# EAGLE design lipo_status (EAGLE 6.6.0)
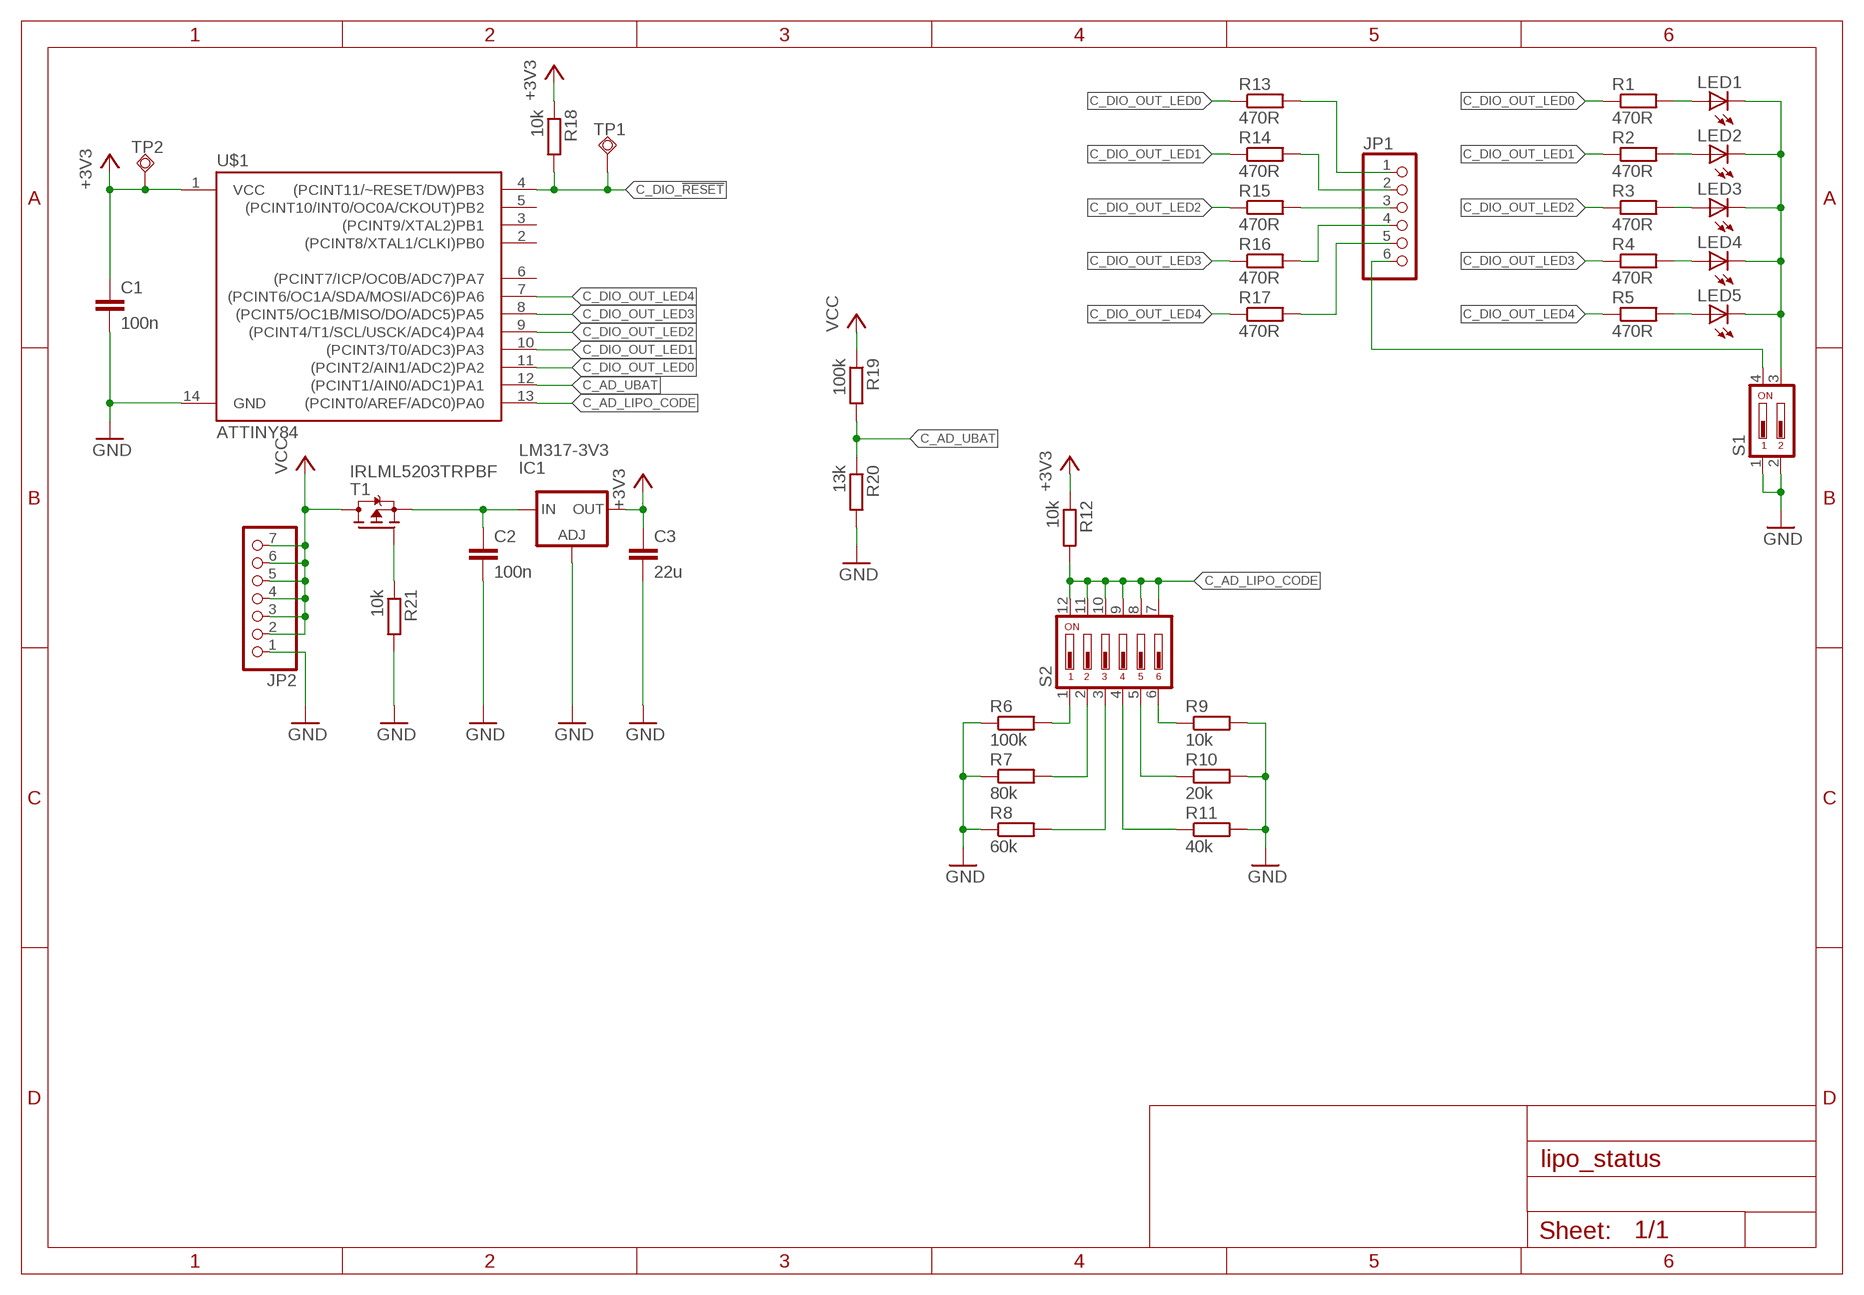
[diagram p0: schematic, sheet 1]

## Parts
C1  100n  C-EUC0603  [C0603]
C2  100n  C-EUC0805  [C0805]
C3  22u  C-EUC0805  [C0805]
IC1  LM317-3V3  LM317MBSTT3  [SOT223]
JP1  PINHD-1X6  [1X06]
JP2  PINHD-1X7  [1X07]
LED1  LEDCHIP-LED0805  [CHIP-LED0805]
LED2  LEDCHIP-LED0805  [CHIP-LED0805]
LED3  LEDCHIP-LED0805  [CHIP-LED0805]
LED4  LEDCHIP-LED0805  [CHIP-LED0805]
LED5  LEDCHIP-LED0805  [CHIP-LED0805]
R1  470R  R-EU_R0603  [R0603]
R2  470R  R-EU_R0603  [R0603]
R3  470R  R-EU_R0603  [R0603]
R4  470R  R-EU_R0603  [R0603]
R5  470R  R-EU_R0603  [R0603]
R6  100k  R-EU_R0603  [R0603]
R7  80k  R-EU_R0603  [R0603]
R8  60k  R-EU_R0603  [R0603]
R9  10k  R-EU_R0603  [R0603]
R10  20k  R-EU_R0603  [R0603]
R11  40k  R-EU_R0603  [R0603]
R12  10k  R-EU_R0603  [R0603]
R13  470R  R-EU_R0603  [R0603]
R14  470R  R-EU_R0603  [R0603]
R15  470R  R-EU_R0603  [R0603]
R16  470R  R-EU_R0603  [R0603]
R17  470R  R-EU_R0603  [R0603]
R18  10k  R-EU_R0603  [R0603]
R19  100k  R-EU_R0603  [R0603]
R20  13k  R-EU_R0603  [R0603]
R21  10k  R-EU_R0603  [R0603]
S1  DIP02YL  [DIP02YL]
S2  DIP06YL  [DIP06YL]
T1  IRLML5203TRPBF  [SOT23]
TP1  TPSQPAD1-13  [P1-13]
TP2  TPSQPAD1-13  [P1-13]
U$1  ATTINY84  [SO14]

## Nets
+3V3: C1.1 C3.1 IC1.4(OUT) R12.1 R18.1 TP2.TP U$1.1(VCC)
C_AD_LIPO_CODE: R12.2 S2.7 S2.8 S2.9 S2.10 S2.11 S2.12 U$1.13((PCINT0/AREF/ADC0)PA0)
C_AD_UBAT: R19.2 R20.1 U$1.12((PCINT1/AIN0/ADC1)PA1)
C_DIO_!RESET: R18.2 TP1.TP U$1.4((PCINT11/~RESET/DW)PB3)
C_DIO_OUT_LED0: R1.1 R13.1 U$1.11((PCINT2/AIN1/ADC2)PA2)
C_DIO_OUT_LED1: R2.1 R14.1 U$1.10((PCINT3/T0/ADC3)PA3)
C_DIO_OUT_LED2: R3.1 R15.1 U$1.9((PCINT4/T1/SCL/USCK/ADC4)PA4)
C_DIO_OUT_LED3: R4.1 R16.1 U$1.8((PCINT5/OC1B/MISO/DO/ADC5)PA5)
C_DIO_OUT_LED4: R5.1 R17.1 U$1.7((PCINT6/OC1A/SDA/MOSI/ADC6)PA6)
GND: C1.2 C2.2 C3.2 IC1.1(ADJ) JP2.1 R6.1 R7.1 R8.1 R9.2 R10.2 R11.2 R20.2 R21.2 S1.1 S1.2 U$1.14(GND)
N$1: LED1.A R1.2
N$2: LED2.A R2.2
N$3: LED3.A R3.2
N$4: LED4.A R4.2
N$5: LED5.A R5.2
N$6: R6.2 S2.1
N$7: R7.2 S2.2
N$8: R8.2 S2.3
N$9: R9.1 S2.6
N$10: R10.1 S2.5
N$11: R11.1 S2.4
N$12: JP1.6 S1.4
N$13: JP1.5 R17.2
N$14: JP1.4 R16.2
N$15: JP1.3 R15.2
N$16: LED1.C LED2.C LED3.C LED4.C LED5.C S1.3
N$17: JP1.2 R14.2
N$18: JP1.1 R13.2
N$19: R21.1 T1.1(G)
N$20: C2.1 IC1.3(IN) T1.2(S)
VCC: JP2.2 JP2.3 JP2.4 JP2.5 JP2.6 JP2.7 R19.1 T1.3(D)
Unconnected: U$1.2((PCINT8/XTAL1/CLKI)PB0) U$1.3((PCINT9/XTAL2)PB1) U$1.5((PCINT10/INT0/OC0A/CKOUT)PB2) U$1.6((PCINT7/ICP/OC0B/ADC7)PA7)

## Library data of the parts
C1-C3 = rcl:C-EU: CAPACITOR, European symbol
IC1 = v-reg:LM317?*: 500 mA Adjustable Output Positive Voltage Regulator Source: http://www.onsemi.co.jp .. LM317M-D.PDF
JP1 = pinhead:PINHD-1X6: PIN HEADER
JP2 = pinhead:PINHD-1X7: PIN HEADER
LED1-LED5 = led:LED: LED OSRAM: - CHIPLED LG R971, LG N971, LY N971, LG Q971, LY Q971, LO R971, LY R971 LH N974, LH R974 LS Q976, LO Q976, LY Q976 LO Q996 - Hyper CHIPLED LW Q18S LB Q993, LB Q99A, LB R99A - SideLED LS A670, LO A670, LY A670, LG A670, LP A670 LB A673, LV A673, LT A673, LW A673 LH A674 LY A675 LS A676, LA A676, LO A676, LY A676, LW A676 LS A679, LY A679, LG A679 - Hyper Micro SIDELED® LS Y876, LA Y876, LO Y876, LY Y876 LT Y87S - SmartLED LW L88C, LW L88S LB L89C, LB L89S, LG L890 LS L89K, LO L89K, LY L89K LS L896, LA L896, LO L896, LY L896 - TOPLED LS T670, LO T670, LY T670, LG T670, LP T670 LSG T670, LSP T670, LSY T670, LOP T670, LYG T670 LG T671, LOG T671, LSG T671 LB T673, LV T673, LT T673, LW T673 LH T674 LS T676, LA T676, LO T676, LY T676, LB T676, LH T676, LSB T676, LW T676 LB T67C, LV T67C, LT T67C, LS T67K, LO T67K, LY T67K, LW E67C LS E67B, LA E67B, LO E67B, LY E67B, LB E67C, LV E67C, LT E67C LW T67C LS T679, LY T679, LG T679 LS T770, LO T770, LY T770, LG T770, LP T770 LB T773, LV T773, LT T773, LW T773 LH T774 LS E675, LA E675, LY E675, LS T675 LS T776, LA T776, LO T776, LY T776, LB T776 LHGB T686 LT T68C, LB T68C - Hyper Mini TOPLED® LB M676 - Mini TOPLED Santana® LG M470 LS M47K, LO M47K, LY M47K Source: http://www.osram.convergy.de LUXEON: - LUMILED® LXK2-PW12-R00, LXK2-PW12-S00, LXK2-PW14-U00, LXK2-PW14-V00 LXK2-PM12-R00, LXK2-PM12-S00, LXK2-PM14-U00 LXK2-PE12-Q00, LXK2-PE12-R00, LXK2-PE12-S00, LXK2-PE14-T00, LXK2-PE14-U00 LXK2-PB12-K00, LXK2-PB12-L00, LXK2-PB12-M00, LXK2-PB14-N00, LXK2-PB14-P00, LXK2-PB14-Q00 LXK2-PR12-L00, LXK2-PR12-M00, LXK2-PR14-Q00, LXK2-PR14-R00 LXK2-PD12-Q00, LXK2-PD12-R00, LXK2-PD12-S00 LXK2-PH12-R00, LXK2-PH12-S00 LXK2-PL12-P00, LXK2-PL12-Q00, LXK2-PL12-R00 Source: www.luxeon.com KINGBRIGHT: KA-3528ASYC Source: www.kingbright.com
R1-R21 = rcl:R-EU_: RESISTOR, European symbol
S1 = switch-dil:DIP02YL: DIL/CODE SWITCH; OC_FARNELL: unknown; OC_NEWARK: unknown
S2 = switch-dil:DIP06YL: DIL/CODE SWITCH; OC_FARNELL: unknown; OC_NEWARK: unknown
T1 = SchlegelAr_Master:IRLML5203TRPBF: IRLML5203TRPBF - MOSFET MOSFT P-Ch -30V -3A 98mOhm 9.5nC Log Lvl last modified: Armin Schlegel, 28.04.2014 http://de.mouser.com/ProductDetail/International-Rectifier/IRLML5203TRPBF/?qs=sGAEpiMZZMshyDBzk1%2fWi5%252bqVgN3%252bWS8t7qb9msI9Rk%3d http://www.mouser.com/ds/2/200/irlml5203pbf-223113.pdf
TP1 TP2 = testpad:TPSQ: Test pad
U$1 = SparkFun-DigitalIC:ATTINY84: Atmel 14-pin 2/4/8kB flash uC; PROD_ID: IC-11285

## Board
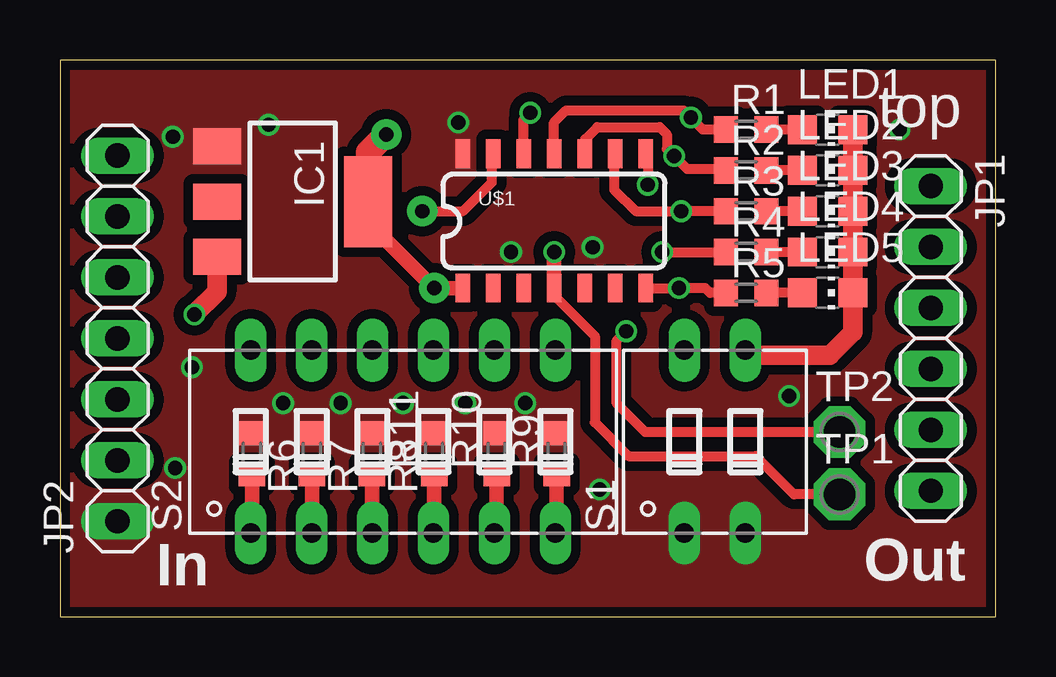
[diagram p1: board, top side]
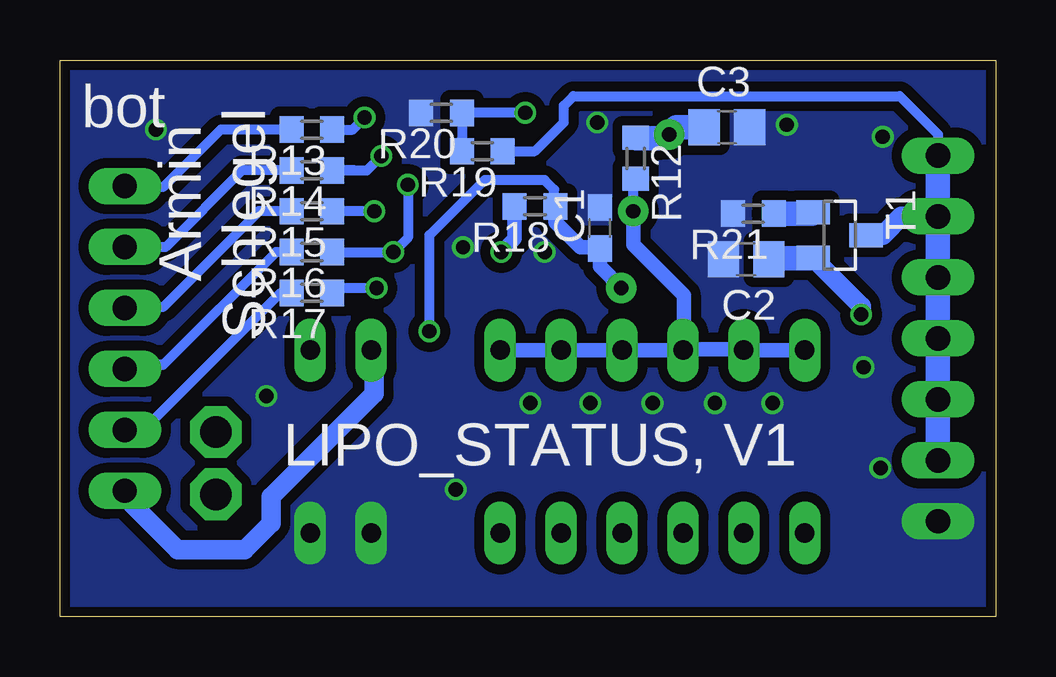
[diagram p2: board, bottom side, seen from below]

Size 39 x 23.2 mm. Coordinates in mm from the lower left corner, seen from the top.
Outline: 0,0 39,0 39,23.2 0,23.2 0,0
Copper layers (1*16): Top 0.035mm / dielectric 1.5mm / Bottom 0.035mm
Design rules "Elecrow_2-layer_eagle_rule": minimum track width 6mil, minimum drill 12mil, track to track 6mil, track to pad 6mil, pad to pad 6mil, via to via 6mil, smd to smd 0mil, copper to edge 10mil, drill to drill 10mil, minimum pad ring 10mil, minimum via ring 6mil, stop-mask expansion 2mil, vias tented up to drill 100mil, thermal gap 10mil

### Footprints (pad centres in the part's own frame; a part is rotated, then mirrored left to right if it is on the bottom)
C0603 = smd 1.1 x 1: 1 -0.85,0; 2 0.85,0
C0805 = smd 1.3 x 1.5: 1 -0.95,0; 2 0.95,0
SOT223 = smd 1.5 x 2: 1 -2.3,-3.15; 2 0,-3.15; 3 2.3,-3.15 | smd 3.8 x 2: 4 0,3.15
1X06 = drill 1.016 long: 1 -6.35,0; 2 -3.81,0; 3 -1.27,0; 4 1.27,0; 5 3.81,0; 6 6.35,0
1X07 = drill 1.016 long: 1 -7.62,0; 2 -5.08,0; 3 -2.54,0; 4 0,0; 5 2.54,0; 6 5.08,0; 7 7.62,0
CHIP-LED0805 = smd 1.2 x 1.2: A 0,-1.05; C 0,1.05
R0603 = smd 1 x 1.1: 1 -0.85,0; 2 0.85,0
DIP02YL = drill 0.813 long: 1 -1.27,-3.81; 2 1.27,-3.81; 3 1.27,3.81; 4 -1.27,3.81
DIP06YL = drill 0.813 long: 1 -6.35,-3.81; 2 -3.81,-3.81; 3 -1.27,-3.81; 4 1.27,-3.81; 5 3.81,-3.81; 6 6.35,-3.81; 7 6.35,3.81; 8 3.81,3.81; 9 1.27,3.81; 10 -1.27,3.81; 11 -3.81,3.81; 12 -6.35,3.81
SOT23 = smd 1 x 1.4: 1 -0.95,-1.1; 2 0.95,-1.1; 3 0,1.1
P1-13 = drill 1.321 pad 2.159 octagon: TP 0,0
SO14 = smd 0.6 x 1.2: 1 -3.81,-2.8; 2 -2.54,-2.8; 3 -1.27,-2.8; 4 0,-2.8; 5 1.27,-2.8; 6 2.54,-2.8; 7 3.81,-2.8; 8 3.81,2.8; 9 2.54,2.8; 10 1.27,2.8; 11 0,2.8; 12 -1.27,2.8; 13 -2.54,2.8; 14 -3.81,2.8

### Placement (x,y rotation side)
C1  16.5,16.2 90 bottom
C2  10.4,14.9 180 bottom
C3  11.2,20.4 0 bottom
IC1  9.7,17.3 270 top
JP1  36.3,11.6 270 top
JP2  2.4,11.6 90 top
LED1  32,20.3 270 top
LED2  32,18.6 270 top
LED3  32,16.9 270 top
LED4  32,15.2 270 top
LED5  32,13.5 270 top
R1  28.6,20.3 0 top
R2  28.6,18.6 0 top
R3  28.6,16.9 0 top
R4  28.6,15.2 0 top
R5  28.6,13.5 0 top
R6  8,6.8 270 top
R7  10.5,6.8 270 top
R8  13,6.8 270 top
R9  20.7,6.8 90 top
R10  18.2,6.8 90 top
R11  15.6,6.8 90 top
R12  15,19.1 270 bottom
R13  28.5,20.3 180 bottom
R14  28.5,18.6 180 bottom
R15  28.5,16.9 180 bottom
R16  28.5,15.2 180 bottom
R17  28.5,13.5 180 bottom
R18  19.2,17.1 180 bottom
R19  21.4,19.4 180 bottom
R20  23.1,21 180 bottom
R21  10.1,16.8 180 bottom
S1  27.3,7.3 0 top
S2  14.3,7.3 0 top
T1  6.5,15.9 270 bottom
TP1  32.5,5.1 0 top
TP2  32.5,7.7 0 top
U$1  20.6,16.5 0 top

### Tracks (layer width: path | path; a pad name or v marks a point on that pad's centre or on a via)
+3V3  (via drill 0.6 pad 0.81, 0.6 pad 1.27)
  Top 0.406: TP2.TP 24.4,7.7 23.2,8.9 23.2,11.5 v23.6,11.9
  Top 0.61: U$1.1 v15.6,13.7 12.85,16.45 IC1.4
  Top 1.016: IC1.4 12.85,19.35 v13.6,20.1
  Bottom 0.406: v23.6,11.9 23.6,15.9 21.3,18.2 18.8,18.2 18.4,17.8 18.4,17.15 R18.1
  Bottom 0.61: v15.6,13.7 16.5,14.6 C1.1 16.55,15.4 17.3,15.4 18.35,16.45 R18.1
  Bottom 1.016: R12.1 14.05,19.95 v13.6,20.1 13.3,20.4 C3.1
C_AD_LIPO_CODE  (via drill 0.6 pad 1.27)
  Top 0.406: v15.1,16.9 16.8,16.9 18,18.1 18,19.24 U$1.13
  Bottom 0.406: v15.1,16.9 15.1,18.15 R12.2
  Bottom 0.61: v15.1,16.9 15.1,15.5 13,13.4 13,11.14 | 13,11.14 S2.10 S2.9 S2.8 S2.7 | 13,11.14 10.52,11.14 S2.11 S2.12
C_AD_UBAT  (via drill 0.6 pad 0.81)
  Top 0.406: U$1.12 19.33,20.73 v19.6,21
  Bottom 0.406: v19.6,21 R20.1 R19.2
C_DIO_!RESET  (via drill 0.6 pad 0.81)
  Top 0.406: TP1.TP 30.6,5.1 29,6.7 23.7,6.7 22.3,8.1 22.3,11.7 20.6,13.4 U$1.4
  Top 0.61: U$1.4 v20.6,15.2
  Bottom 0.61: v20.6,15.2 20.05,15.75 R18.2
C_DIO_OUT_LED0  (via drill 0.6 pad 0.81)
  Top 0.406: U$1.11 20.6,20.6 21.1,21.1 26,21.1 v26.3,20.8 26.8,20.3 R1.1
  Bottom 0.406: R13.1 26.8,20.3 v26.3,20.8
C_DIO_OUT_LED1  (via drill 0.6 pad 0.81)
  Top 0.406: U$1.10 21.9,19.33 21.9,19.9 22.4,20.4 25,20.4 25.3,20.1 25.3,19.5 v25.6,19.2 26.15,18.65 27.7,18.65 R2.1
  Bottom 0.406: 26.7,18.6 R14.1 26.2,18.6 v25.6,19.2
C_DIO_OUT_LED2  (via drill 0.6 pad 0.81)
  Top 0.406: U$1.9 23.1,19.26 23.1,17.8 24,16.9 v25.9,16.9 R3.1
  Bottom 0.406: v25.9,16.9 R15.1
C_DIO_OUT_LED3  (via drill 0.6 pad 0.81)
  Top 0.406: R16.1 R4.1 v25.1,15.2 | U$1.8 24.5,19.21 v24.5,18
  Bottom 0.406: R16.1 v25.1,15.2 24.5,15.8 v24.5,18
C_DIO_OUT_LED4  (via drill 0.6 pad 0.81)
  Top 0.406: U$1.7 v25.8,13.7 26.9,13.7 27.1,13.5 R5.1
  Bottom 0.406: v25.8,13.7 27.45,13.7 R17.1
GND  (via drill 0.6 pad 0.81)
  other vias: 22.2,15.4 8.7,20.5 16.6,20.6 35,20.3 4.7,20 4.8,6.2 5.5,10.4 22.5,5.3 14.3,8.9 11.7,8.9 9.3,8.9 16.9,8.9 19.4,8.9 30.4,9.2 18.8,15.2
  pour Top (isolate 0.406, no thermals): 0,23.2 39,23.2 39,0 0,0
  pour Bottom (isolate 0.406, no thermals): 0,23.2 39,23.2 39,0 0,0
N$1
  Top 0.406: LED1.A R1.2
N$2
  Top 0.406: LED2.A R2.2
N$3
  Top 0.406: LED3.A R3.2
N$4
  Top 0.406: LED4.A R4.2
N$5
  Top 0.406: LED5.A R5.2
N$6
  Top 0.61: R6.2 8,3.54 S2.1
N$7
  Top 0.61: R7.2 S2.2
N$8
  Top 0.61: R8.2 13,3.52 S2.3
N$9
  Top 0.61: R9.1 20.7,3.54 S2.6
N$10
  Top 0.61: R10.1 18.2,3.58 S2.5
N$11
  Top 0.61: R11.1 15.6,3.52 S2.4
N$12
  Bottom 0.813: JP1.6 36.3,5 34.1,2.8 31.3,2.8 30.2,3.9 30.2,5 25.9,9.3 25.9,10.98 S1.4
N$13
  Bottom 0.406: R17.2 29.8,13.5 35.2,8.1 35.99,8.1 JP1.5
N$14
  Bottom 0.406: R16.2 30,15.2 34.7,10.5 36.13,10.5 JP1.4
N$15
  Bottom 0.406: R15.2 30.7,16.9 34.7,12.9 36.27,12.9 JP1.3
N$16
  Top 0.813: LED1.C LED2.C LED3.C LED4.C LED5.C 33.05,11.85 32.1,10.9 28.78,10.9 S1.3
N$17
  Bottom 0.406: R14.2 31.4,18.6 34.6,15.4 JP1.2
N$18
  Bottom 0.406: R13.2 32.3,20.3 34.7,17.9 36.25,17.9 JP1.1
N$19
  Bottom 1.016: R21.1 7.65,16.8 T1.1
N$20  (via drill 0.6)
  Top 0.813: IC1.3 6.55,13.55 v5.6,12.6
  Bottom 0.813: v5.6,12.6 5.6,12.95 T1.2
  Bottom 1.016: T1.2 9.4,14.95 C2.1
VCC
  Bottom 0.406: R19.1 19.2,19.4 18,20.6 18,21.3 17.6,21.7 4,21.7 2.4,20.1 JP2.7
  Bottom 0.813: JP2.6 3.92,16.68 4.7,15.9 T1.3
  Bottom 1.016: JP2.2 JP2.3 JP2.4 JP2.5 JP2.6 JP2.7

### Text on the board
tPlace: top | Out | In
bPlace: Armin / Schlegel | bot | LIPO_STATUS, V1